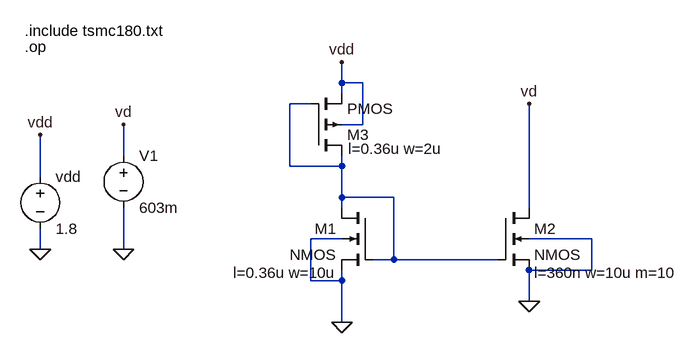
[diagram p0: schematic CurrentMirrorSimple -1 - NEW.asc]
CurrentMirrorSimple -1 - NEW.asc, the LTspice schematic file:
Version 4
SHEET 1 880 680
WIRE -64 32 -64 0
WIRE -32 32 -64 32
WIRE -64 48 -64 32
WIRE -112 64 -144 64
WIRE -32 96 -32 32
WIRE -32 96 -64 96
WIRE -400 144 -400 96
WIRE -144 160 -144 64
WIRE -64 160 -64 144
WIRE -64 160 -144 160
WIRE -528 176 -528 112
WIRE -64 208 -64 160
WIRE 16 208 -64 208
WIRE -64 224 -64 208
WIRE 224 224 224 64
WIRE -64 272 -112 272
WIRE 320 272 224 272
WIRE -528 288 -528 256
WIRE -400 288 -400 224
WIRE 16 304 16 208
WIRE 16 304 -16 304
WIRE 176 304 16 304
WIRE 320 320 320 272
WIRE 320 320 224 320
WIRE -112 336 -112 272
WIRE -64 336 -64 320
WIRE -64 336 -112 336
WIRE 224 368 224 320
WIRE -64 400 -64 336
FLAG -64 400 0
FLAG -528 288 0
FLAG -528 112 vdd
FLAG -64 0 vdd
FLAG 224 368 0
FLAG -400 96 vd
FLAG -400 288 0
FLAG 224 64 vd
SYMBOL nmos4 -16 224 M0
WINDOW 123 56 100 Left 2
SYMATTR Value2 l=0.36u w=10u
SYMATTR InstName M1
SYMBOL voltage -528 160 R0
WINDOW 123 0 0 Left 0
WINDOW 39 0 0 Left 0
SYMATTR InstName vdd
SYMATTR Value 1.8
SYMBOL nmos4 176 224 R0
WINDOW 123 56 100 Left 2
SYMATTR Value2 l=360n w=10u m=10
SYMATTR InstName M2
SYMBOL voltage -400 128 R0
WINDOW 123 0 0 Left 0
WINDOW 39 0 0 Left 0
SYMATTR InstName V1
SYMATTR Value 603m
SYMBOL pmos4 -112 144 M180
WINDOW 123 58 11 Left 2
SYMATTR Value2 l=0.36u w=2u
SYMATTR InstName M3
TEXT -552 -48 Left 2 !.include tsmc180.txt
TEXT -552 -24 Left 2 !.op

The netlist it stands for:
* CurrentMirrorSimple -1 - NEW.asc
M1 N001 N001 0 0 NMOS l=0.36u w=10u
vdd vdd 0 1.8
M2 vd N001 0 0 NMOS l=360n w=10u m=10
V1 vd 0 603m
M3 N001 N001 vdd vdd PMOS l=0.36u w=2u
.model NMOS NMOS
.model PMOS PMOS
.lib standard.mos
.include tsmc180.txt
.op
.backanno
.end